# Altium schematic sheet FPGA.SchDoc: FIT_PM12 board
size 420 x 297 mm; CheckedBy: G.Kasprowicz; Author: INR Moscow; CompanyName: WUT ISE; DrawnBy: M.Podgórski; Organization: WUT ISE; Address1: PW ISE; Address2: Nowowiejska 15/19 00-665 Warsaw; Address3: gkasprow@gmail.com; Revision: 2; SheetNumber: -; SheetTotal: -; ModifiedBy: -; CheckedDate: -; Title2: Title 2; DivGrp: WUT ISE; Designer: INR RAS; ModifiedDate: -; ProjectName: Sensor Box
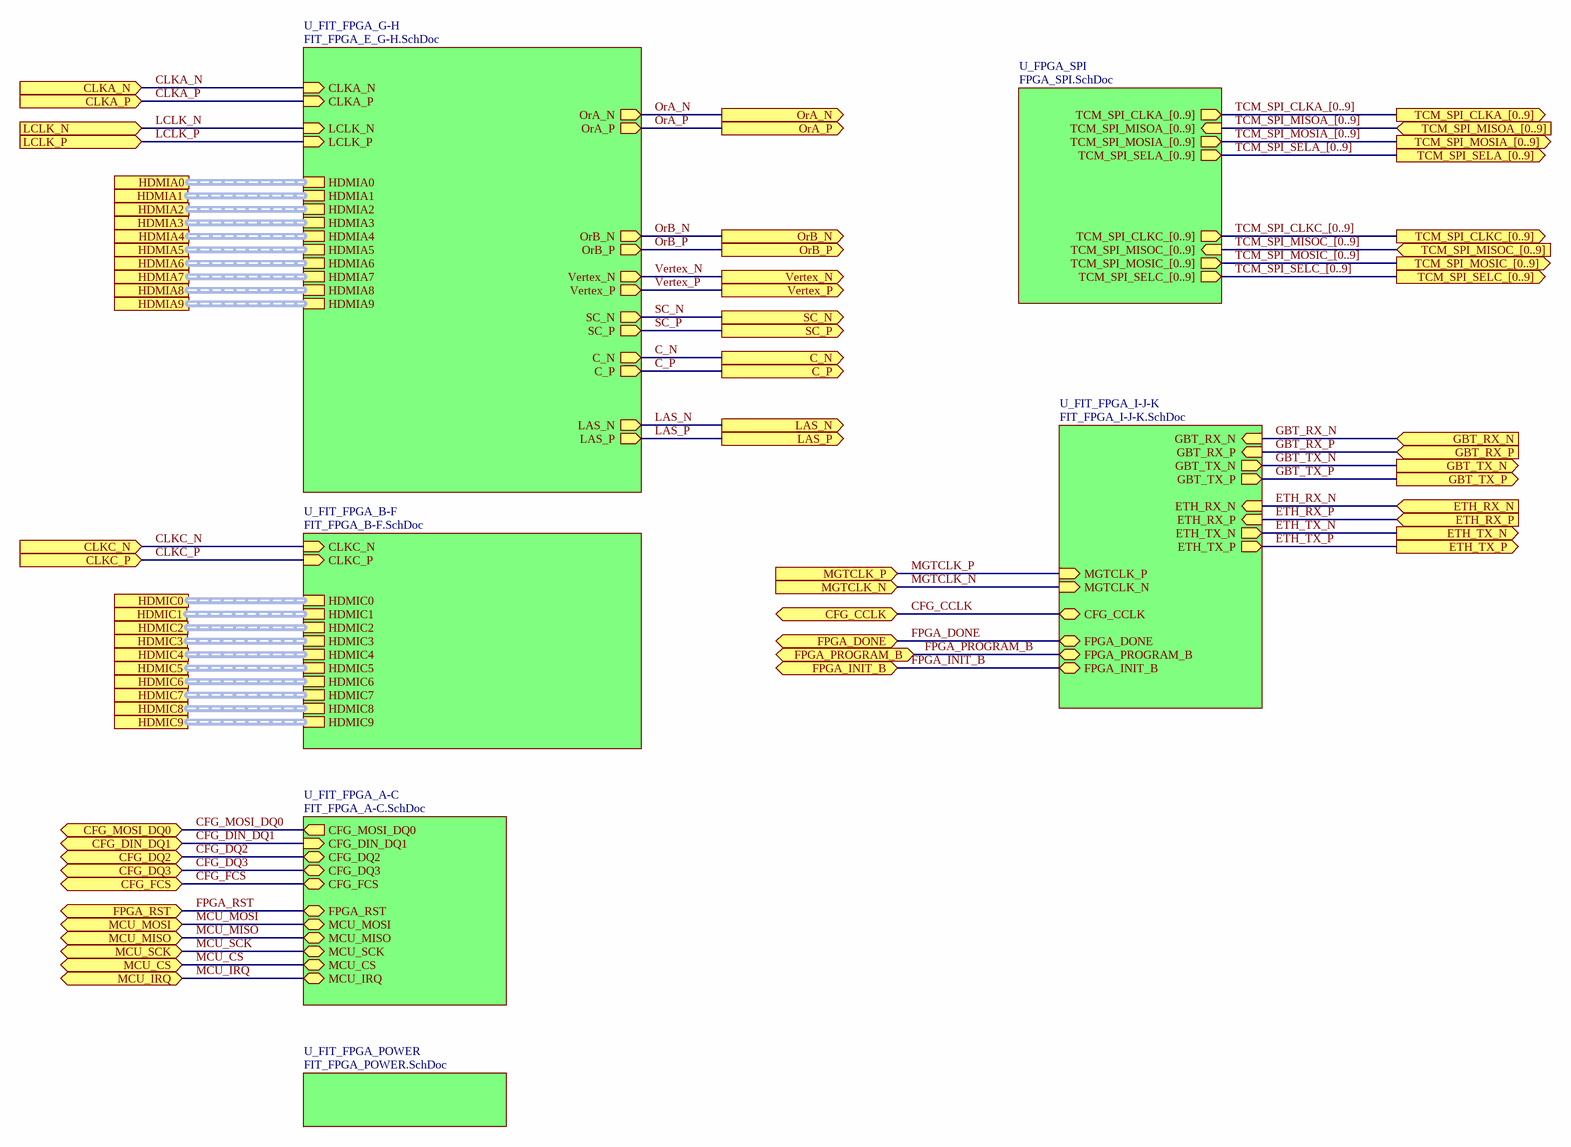
[diagram p0: FPGA.SchDoc]

## Sub-sheets
U_FIT_FPGA_A-C = FIT_FPGA_A-C.SchDoc: CFG_MOSI_DQ0 (out), CFG_DIN_DQ1 (in), CFG_DQ2 (bidir), CFG_DQ3 (bidir), CFG_FCS (bidir), MCU_MISO (bidir), MCU_CS (bidir), MCU_IRQ (bidir), MCU_MOSI (bidir), FPGA_RST (bidir), MCU_SCK (bidir)
U_FIT_FPGA_B-F = FIT_FPGA_B-F.SchDoc: CLKC_P (in), CLKC_N (in), HDMIC8 (harness HDMI_SIG), HDMIC9 (harness HDMI_SIG), HDMIC6 (harness HDMI_SIG), HDMIC7 (harness HDMI_SIG), HDMIC4 (harness HDMI_SIG), HDMIC5 (harness HDMI_SIG), HDMIC2 (harness HDMI_SIG), HDMIC3 (harness HDMI_SIG), HDMIC0 (harness HDMI_SIG), HDMIC1 (harness HDMI_SIG)
U_FIT_FPGA_G-H = FIT_FPGA_E_G-H.SchDoc: LCLK_P (in), LCLK_N (in), LAS_P (out), LAS_N (out), OrA_P (out), OrA_N (out), SC_P (out), SC_N (out), C_P (out), C_N (out), OrB_P (out), OrB_N (out), Vertex_P (out), Vertex_N (out), CLKA_P (in), CLKA_N (in), HDMIA8 (harness HDMI_SIG), HDMIA9 (harness HDMI_SIG), HDMIA6 (harness HDMI_SIG), HDMIA7 (harness HDMI_SIG), HDMIA4 (harness HDMI_SIG), HDMIA5 (harness HDMI_SIG), HDMIA2 (harness HDMI_SIG), HDMIA3 (harness HDMI_SIG), HDMIA0 (harness HDMI_SIG), HDMIA1 (harness HDMI_SIG)
U_FIT_FPGA_I-J-K = FIT_FPGA_I-J-K.SchDoc: ETH_TX_P (out), ETH_TX_N (out), ETH_RX_P (in), ETH_RX_N (in), GBT_RX_P (in), GBT_RX_N (in), GBT_TX_P (out), GBT_TX_N (out), MGTCLK_P (in), MGTCLK_N (in), CFG_CCLK (bidir), FPGA_PROGRAM_B (bidir), FPGA_INIT_B (bidir), FPGA_DONE (bidir)
U_FIT_FPGA_POWER = FIT_FPGA_POWER.SchDoc: no entries
U_FPGA_SPI = FPGA_SPI.SchDoc: TCM_SPI_SELC_[0..9] (out), TCM_SPI_MOSIC_[0..9] (out), TCM_SPI_MISOC_[0..9] (in), TCM_SPI_CLKC_[0..9] (out), TCM_SPI_CLKA_[0..9] (out), TCM_SPI_MOSIA_[0..9] (out), TCM_SPI_MISOA_[0..9] (in), TCM_SPI_SELA_[0..9] (out)

## Ports
C_N (out), C_P (out), CFG_CCLK (bidir), CFG_DIN_DQ1 (bidir), CFG_DQ2 (bidir), CFG_DQ3 (bidir), CFG_FCS (bidir), CFG_MOSI_DQ0 (bidir), CLKA_N (in), CLKA_P (in), CLKC_N (in), CLKC_P (in), ETH_RX_N (in), ETH_RX_P (in), ETH_TX_N (out), ETH_TX_P (out), FPGA_DONE (bidir), FPGA_INIT_B (bidir), FPGA_PROGRAM_B (bidir), FPGA_RST (bidir), GBT_RX_N (in), GBT_RX_P (in), GBT_TX_N (out), GBT_TX_P (out), HDMIA0 (harness HDMI_SIG), HDMIA1 (harness HDMI_SIG), HDMIA2 (harness HDMI_SIG), HDMIA3 (harness HDMI_SIG), HDMIA4 (harness HDMI_SIG), HDMIA5 (harness HDMI_SIG), HDMIA6 (harness HDMI_SIG), HDMIA7 (harness HDMI_SIG), HDMIA8 (harness HDMI_SIG), HDMIA9 (harness HDMI_SIG), HDMIC0 (harness HDMI_SIG), HDMIC1 (harness HDMI_SIG), HDMIC2 (harness HDMI_SIG), HDMIC3 (harness HDMI_SIG), HDMIC4 (harness HDMI_SIG), HDMIC5 (harness HDMI_SIG), HDMIC6 (harness HDMI_SIG), HDMIC7 (harness HDMI_SIG), HDMIC8 (harness HDMI_SIG), HDMIC9 (harness HDMI_SIG), LAS_N (out), LAS_P (out), LCLK_N (in), LCLK_P (in), MCU_CS (bidir), MCU_IRQ (bidir), MCU_MISO (bidir), MCU_MOSI (bidir), MCU_SCK (bidir), MGTCLK_N (in), MGTCLK_P (in), OrA_N (out), OrA_P (out), OrB_N (out), OrB_P (out), SC_N (out), SC_P (out), TCM_SPI_CLKA_[0..9] (out), TCM_SPI_CLKC_[0..9] (out), TCM_SPI_MISOA_[0..9] (in), TCM_SPI_MISOC_[0..9] (in), TCM_SPI_MOSIA_[0..9] (out), TCM_SPI_MOSIC_[0..9] (out), TCM_SPI_SELA_[0..9] (out), TCM_SPI_SELC_[0..9] (out), Vertex_N (out), Vertex_P (out)

## Nets
C_N: port C_N, sheet U_FIT_FPGA_G-H/C_N
C_P: port C_P, sheet U_FIT_FPGA_G-H/C_P
CFG_CCLK: port CFG_CCLK, sheet U_FIT_FPGA_I-J-K/CFG_CCLK
CFG_DIN_DQ1: port CFG_DIN_DQ1, sheet U_FIT_FPGA_A-C/CFG_DIN_DQ1
CFG_DQ2: port CFG_DQ2, sheet U_FIT_FPGA_A-C/CFG_DQ2
CFG_DQ3: port CFG_DQ3, sheet U_FIT_FPGA_A-C/CFG_DQ3
CFG_FCS: port CFG_FCS, sheet U_FIT_FPGA_A-C/CFG_FCS
CFG_MOSI_DQ0: port CFG_MOSI_DQ0, sheet U_FIT_FPGA_A-C/CFG_MOSI_DQ0
CLKA_N: port CLKA_N, sheet U_FIT_FPGA_G-H/CLKA_N
CLKA_P: port CLKA_P, sheet U_FIT_FPGA_G-H/CLKA_P
CLKC_N: port CLKC_N, sheet U_FIT_FPGA_B-F/CLKC_N
CLKC_P: port CLKC_P, sheet U_FIT_FPGA_B-F/CLKC_P
ETH_RX_N: port ETH_RX_N, sheet U_FIT_FPGA_I-J-K/ETH_RX_N
ETH_RX_P: port ETH_RX_P, sheet U_FIT_FPGA_I-J-K/ETH_RX_P
ETH_TX_N: port ETH_TX_N, sheet U_FIT_FPGA_I-J-K/ETH_TX_N
ETH_TX_P: port ETH_TX_P, sheet U_FIT_FPGA_I-J-K/ETH_TX_P
FPGA_DONE: port FPGA_DONE, sheet U_FIT_FPGA_I-J-K/FPGA_DONE
FPGA_INIT_B: port FPGA_INIT_B, sheet U_FIT_FPGA_I-J-K/FPGA_INIT_B
FPGA_PROGRAM_B: port FPGA_PROGRAM_B, sheet U_FIT_FPGA_I-J-K/FPGA_PROGRAM_B
FPGA_RST: port FPGA_RST, sheet U_FIT_FPGA_A-C/FPGA_RST
GBT_RX_N: port GBT_RX_N, sheet U_FIT_FPGA_I-J-K/GBT_RX_N
GBT_RX_P: port GBT_RX_P, sheet U_FIT_FPGA_I-J-K/GBT_RX_P
GBT_TX_N: port GBT_TX_N, sheet U_FIT_FPGA_I-J-K/GBT_TX_N
GBT_TX_P: port GBT_TX_P, sheet U_FIT_FPGA_I-J-K/GBT_TX_P
LAS_N: port LAS_N, sheet U_FIT_FPGA_G-H/LAS_N
LAS_P: port LAS_P, sheet U_FIT_FPGA_G-H/LAS_P
LCLK_N: port LCLK_N, sheet U_FIT_FPGA_G-H/LCLK_N
LCLK_P: port LCLK_P, sheet U_FIT_FPGA_G-H/LCLK_P
MCU_CS: port MCU_CS, sheet U_FIT_FPGA_A-C/MCU_CS
MCU_IRQ: port MCU_IRQ, sheet U_FIT_FPGA_A-C/MCU_IRQ
MCU_MISO: port MCU_MISO, sheet U_FIT_FPGA_A-C/MCU_MISO
MCU_MOSI: port MCU_MOSI, sheet U_FIT_FPGA_A-C/MCU_MOSI
MCU_SCK: port MCU_SCK, sheet U_FIT_FPGA_A-C/MCU_SCK
MGTCLK_N: port MGTCLK_N, sheet U_FIT_FPGA_I-J-K/MGTCLK_N
MGTCLK_P: port MGTCLK_P, sheet U_FIT_FPGA_I-J-K/MGTCLK_P
OrA_N: port OrA_N, sheet U_FIT_FPGA_G-H/OrA_N
OrA_P: port OrA_P, sheet U_FIT_FPGA_G-H/OrA_P
OrB_N: port OrB_N, sheet U_FIT_FPGA_G-H/OrB_N
OrB_P: port OrB_P, sheet U_FIT_FPGA_G-H/OrB_P
SC_N: port SC_N, sheet U_FIT_FPGA_G-H/SC_N
SC_P: port SC_P, sheet U_FIT_FPGA_G-H/SC_P
Vertex_N: port Vertex_N, sheet U_FIT_FPGA_G-H/Vertex_N
Vertex_P: port Vertex_P, sheet U_FIT_FPGA_G-H/Vertex_P

## Buses and harness runs
bus TCM_SPI_CLKA_[0..9] = port TCM_SPI_CLKA_[0..9] = sheet U_FPGA_SPI/TCM_SPI_CLKA_[0..9]
bus TCM_SPI_CLKC_[0..9] = port TCM_SPI_CLKC_[0..9] = sheet U_FPGA_SPI/TCM_SPI_CLKC_[0..9]
bus TCM_SPI_MISOA_[0..9] = port TCM_SPI_MISOA_[0..9] = sheet U_FPGA_SPI/TCM_SPI_MISOA_[0..9]
bus TCM_SPI_MISOC_[0..9] = port TCM_SPI_MISOC_[0..9] = sheet U_FPGA_SPI/TCM_SPI_MISOC_[0..9]
bus TCM_SPI_MOSIA_[0..9] = port TCM_SPI_MOSIA_[0..9] = sheet U_FPGA_SPI/TCM_SPI_MOSIA_[0..9]
bus TCM_SPI_MOSIC_[0..9] = port TCM_SPI_MOSIC_[0..9] = sheet U_FPGA_SPI/TCM_SPI_MOSIC_[0..9]
bus TCM_SPI_SELA_[0..9] = port TCM_SPI_SELA_[0..9] = sheet U_FPGA_SPI/TCM_SPI_SELA_[0..9]
bus TCM_SPI_SELC_[0..9] = port TCM_SPI_SELC_[0..9] = sheet U_FPGA_SPI/TCM_SPI_SELC_[0..9]
harness port HDMIA0 = sheet U_FIT_FPGA_G-H/HDMIA0
harness port HDMIA1 = sheet U_FIT_FPGA_G-H/HDMIA1
harness port HDMIA2 = sheet U_FIT_FPGA_G-H/HDMIA2
harness port HDMIA3 = sheet U_FIT_FPGA_G-H/HDMIA3
harness port HDMIA4 = sheet U_FIT_FPGA_G-H/HDMIA4
harness port HDMIA5 = sheet U_FIT_FPGA_G-H/HDMIA5
harness port HDMIA6 = sheet U_FIT_FPGA_G-H/HDMIA6
harness port HDMIA7 = sheet U_FIT_FPGA_G-H/HDMIA7
harness port HDMIA8 = sheet U_FIT_FPGA_G-H/HDMIA8
harness port HDMIA9 = sheet U_FIT_FPGA_G-H/HDMIA9
harness port HDMIC0 = sheet U_FIT_FPGA_B-F/HDMIC0
harness port HDMIC1 = sheet U_FIT_FPGA_B-F/HDMIC1
harness port HDMIC2 = sheet U_FIT_FPGA_B-F/HDMIC2
harness port HDMIC3 = sheet U_FIT_FPGA_B-F/HDMIC3
harness port HDMIC4 = sheet U_FIT_FPGA_B-F/HDMIC4
harness port HDMIC5 = sheet U_FIT_FPGA_B-F/HDMIC5
harness port HDMIC6 = sheet U_FIT_FPGA_B-F/HDMIC6
harness port HDMIC7 = sheet U_FIT_FPGA_B-F/HDMIC7
harness port HDMIC8 = sheet U_FIT_FPGA_B-F/HDMIC8
harness port HDMIC9 = sheet U_FIT_FPGA_B-F/HDMIC9

## Notes on the sheet
- Project/Equipment
- Document
- Designer
- Drawn by
- Check.by
- Copyright WUT ISE 2024.
  This documentation describes Open Hardware and is licensed under the CERN OHL v.2. You may redistribute and modify this documentation under the terms of the CERN OHL v.2. (http://ohwr.org/CERNOHL). This documentation is distributed WITHOUT ANY EXPRESS OR IMPLIED WARRANTY, INCLUDING OF MERCHANTABILITY, SATISFACTORY QUALITY AND FITNESS FOR A PARTICULAR PURPOSE. Please see the CERN OHL v.2 for applicable conditions.
- Contact
- File
- Last Mod.
- Print Date
- Sheet
- Size
- A3
- of
- Rev